# EAGLE design IOIO-OTG (EAGLE 7.2.0)
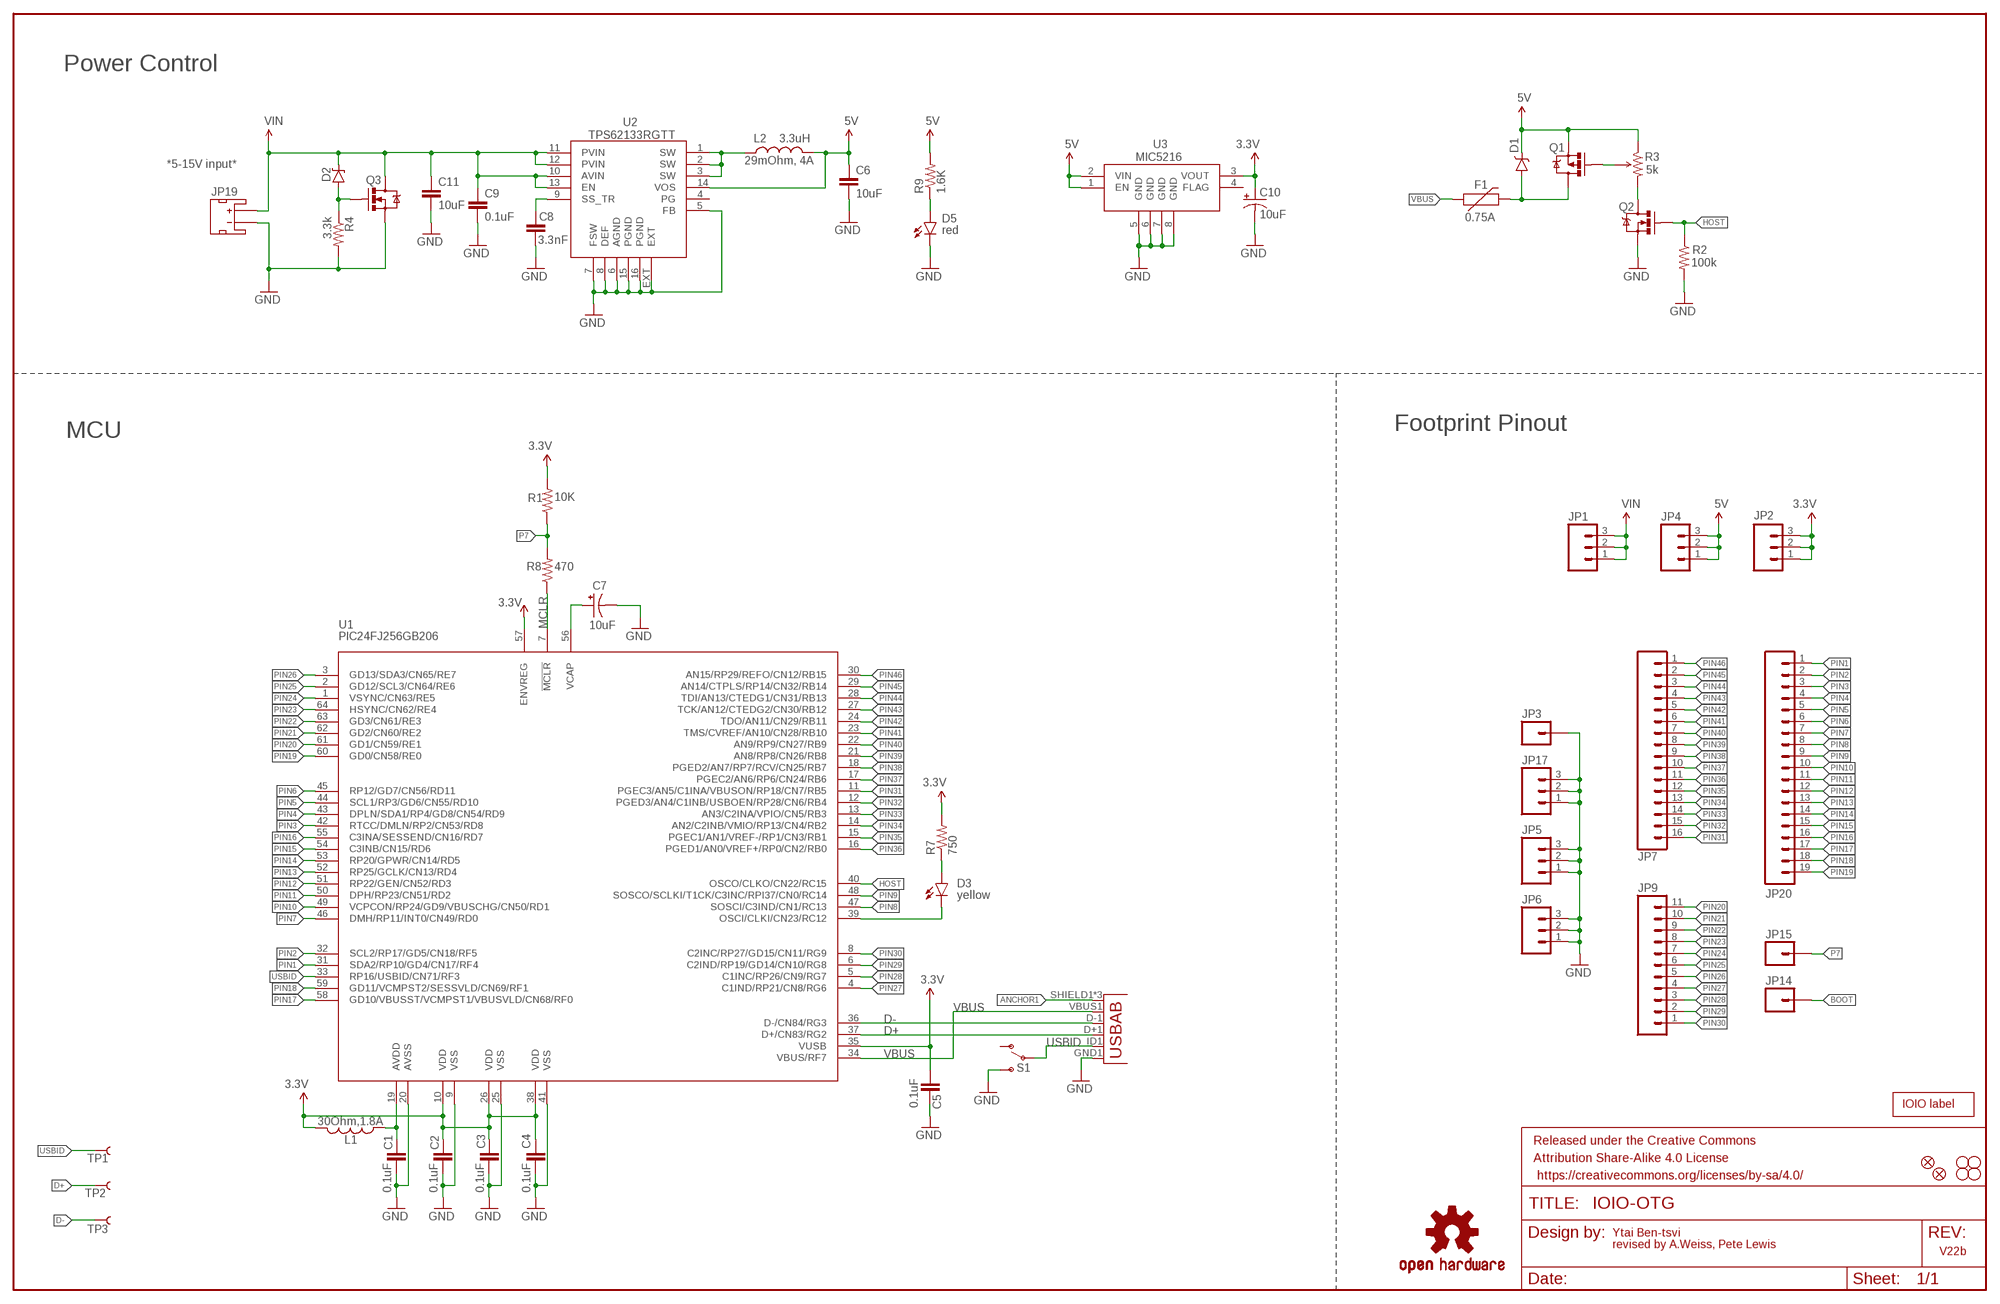
[diagram p0: schematic, sheet 1]

## Parts
C1  0.1uF  0.1UF-25V(+80/-20%)(0603)  [0603-CAP]
C2  0.1uF  0.1UF-25V(+80/-20%)(0603)  [0603-CAP]
C3  0.1uF  0.1UF-25V(+80/-20%)(0603)  [0603-CAP]
C4  0.1uF  0.1UF-25V(+80/-20%)(0603)  [0603-CAP]
C5  0.1uF  0.1UF-25V(+80/-20%)(0603)  [0603-CAP]
C6  10uF  10UF10V10%(0805)  [0805-CAP]
C7  10uF  10UF-16V-10%(TANT)  [EIA3216]
C8  3.3nF  3.3NF-100V-10%(0603)  [0603-CAP]
C9  0.1uF  0.1UF-25V(+80/-20%)(0603)  [0603-CAP]
C10  10uF  10UF-16V-10%(TANT)  [EIA3216]
C11  10uF  10UF50V20%(1210)  [1210]
D1  B340A  DIODE-SCHOTTKY-B340A  [SMA-DIODE]
D2  DZ2J160M0L  DIODE-ZENERDZ2J150M0L  [PANASONIC_SMINI2-F5-B]
D3  Yellow  LED-YELLOW0603-SMART  [LED-0603]
D5  Red  LED-RED0603-SMART  [LED-0603]
F1  0.75A  PTCSMD  [PTC-1206]
FRAME2  FRAME-LEDGER  [CREATIVE_COMMONS]
JP1  M03PTH  [1X03]
JP2  M03PTH  [1X03]
JP3  M01PTH  [1X01]
JP4  M03PTH  [1X03]
JP5  M03PTH  [1X03]
JP6  M03PTH  [1X03]
JP7  M161X16_NO_SILK  [1X16_NO_SILK]
JP8  FIDUCIALUFIDUCIAL  [MICRO-FIDUCIAL]
JP9  M111X11_NO_SILK  [1X11_NO_SILK]
JP10  STAND-OFF  [STAND-OFF]
JP11  STAND-OFF  [STAND-OFF]
JP12  STAND-OFF  [STAND-OFF]
JP13  STAND-OFF  [STAND-OFF]
JP14  M01PTH  [1X01]
JP15  M01PTH  [1X01]
JP16  FIDUCIALUFIDUCIAL  [MICRO-FIDUCIAL]
JP17  M03PTH  [1X03]
JP19  JST  JST_2MM_MALE  [JST-2-SMD]
JP20  M191X19_NO_SILK  [1X19_NO_SILK]
JP21  AB MICRO USB  USB-ABCONN-11794  [USB-AB-MICRO-SMD_V03]
L1  30Ohm,1.8A  INDUCTOR30OHM,1.8A  [0603]
L2  VLC5045T-3R3N  INDUCTORCR54-3.3UH  [CR54]
LOGO1  OSHW-LOGOS  [OSHW-LOGO-S]
Q1  IRLML2244  MOSFET-PCHANNELIRLML2244  [SOT23-3]
Q2  2N7002PW  MOSFET-NCHANNEL2N7002PW  [SOT323]
Q3  MOSFET-NCHANNELAO3404A  [SOT23-3]
R1  10K  10KOHM-1/10W-1%(0603)0603  [0603-RES]
R2  100k  100KOHM-1/10W-1%(0603)  [0603-RES]
R3  TS53YL502MR10  TRIMPOTRES-11156  [TRIMPOT_5MM]
R4  3.3k  3.3KOHM1/10W1%(0603)  [0603-RES]
R7  750  750OHM1/10W1%(0603)0603  [0603-RES]
R8  470  470OHM1/10W1%(0603)  [0603-RES]
R9  1.6K  1.6KOHM-1/10W-1%(0603)0603  [0603-RES]
S1  SWITCH_SPDT  [KPS-1290]
TP1  TEST-POINT3  [PAD.03X.03]
TP2  TEST-POINT3  [PAD.03X.03]
TP3  TEST-POINT3  [PAD.03X.03]
U1  PIC24FJ256GB206  PIC24FXXXGPX06  [PIC24FXXX_TQFP64]
U2  TPS62133RGTT  TPS62133RGTT""  [QFN16-3X3MM_1:1_V03]
U3  MIC5216  V_REG_MIC5216  [MSOP8]
U$6  IOIO-OTG  [IOIO-OTG-COPPER-EXPOSED]

## Nets
3.3V: C2.1 C3.1 C4.1 C5.1 C10.A(+) JP2.1 JP2.2 JP2.3 L1.2 R1.2 R7.2 U1.10(VDD) U1.26(VDD) U1.35(VUSB) U1.38(VDD) U1.57(ENVREG) U3.3(VOUT)
5V: C6.1 D1.C JP4.1 JP4.2 JP4.3 L2.P$2 Q1.2(S) R3.A(CCW) R9.2 U2.14(VOS) U3.1(EN) U3.2(VIN)
ANCHOR1: JP21.SHIELD1(SHIELD) JP21.SHIELD2(SHIELD) JP21.SHIELD3(SHIELD)
BOOT: D3.C JP14.1 U1.39(OSCI/CLKI/CN23/RC12)
D+: JP21.D+1(D+) TP2.P$1 U1.37(D+/CN83/RG2)
D-: JP21.D-1(D-) TP3.P$1 U1.36(D-/CN84/RG3)
GND: C1.2 C2.2 C3.2 C4.2 C5.2 C6.2 C7.C(-) C8.2 C9.2 C10.C(-) C11.2 D5.C JP3.1 JP5.1 JP5.2 JP5.3 JP6.1 JP6.2 JP6.3 JP17.1 JP17.2 JP17.3 JP19.1(-) JP21.GND1(GND) Q2.2(S) Q3.2(S) R2.2 R4.2 S1.S U1.9(VSS) U1.20(AVSS) U1.25(VSS) U1.41(VSS) U2.5(FB) U2.6(AGND) U2.7(FSW) U2.8(DEF) U2.15(PGND) U2.16(PGND) U2.EXT U3.5(GND) U3.6(GND) U3.7(GND) U3.8(GND)
HOST: Q2.1(G) R2.1 U1.40(OSCO/CLKO/CN22/RC15)
MCLR: R8.1 U1.7(!MCLR)
N$1: Q1.1(G) R3.B(WIPER)
N$2: D3.A R7.1
N$3: D5.A R9.1
N$4: D1.A F1.2 Q1.3(D)
N$5: C7.A(+) U1.56(VCAP)
N$6: L2.P$1 U2.1(SW) U2.2(SW) U2.3(SW)
N$7: C8.1 U2.9(SS_TR)
N$8: Q2.3(D) R3.C(CW)
N$9: C1.1 L1.1 U1.19(AVDD)
N$12: D2.A Q3.1(G) R4.1
P7: JP15.1 R1.1 R8.2
PIN1: JP20.1 U1.31(SDA2/RP10/GD4/CN17/RF4)
PIN2: JP20.2 U1.32(SCL2/RP17/GD5/CN18/RF5)
PIN3: JP20.3 U1.42(RTCC/DMLN/RP2/CN53/RD8)
PIN4: JP20.4 U1.43(DPLN/SDA1/RP4/GD8/CN54/RD9)
PIN5: JP20.5 U1.44(SCL1/RP3/GD6/CN55/RD10)
PIN6: JP20.6 U1.45(RP12/GD7/CN56/RD11)
PIN7: JP20.7 U1.46(DMH/RP11/INT0/CN49/RD0)
PIN8: JP20.8 U1.47(SOSCI/C3IND/CN1/RC13)
PIN9: JP20.9 U1.48(SOSCO/SCLKI/T1CK/C3INC/RPI37/CN0/RC14)
PIN10: JP20.10 U1.49(VCPCON/RP24/GD9/VBUSCHG/CN50/RD1)
PIN11: JP20.11 U1.50(DPH/RP23/CN51/RD2)
PIN12: JP20.12 U1.51(RP22/GEN/CN52/RD3)
PIN13: JP20.13 U1.52(RP25/GCLK/CN13/RD4)
PIN14: JP20.14 U1.53(RP20/GPWR/CN14/RD5)
PIN15: JP20.15 U1.54(C3INB/CN15/RD6)
PIN16: JP20.16 U1.55(C3INA/SESSEND/CN16/RD7)
PIN17: JP20.17 U1.58(GD10/VBUSST/VCMPST1/VBUSVLD/CN68/RF0)
PIN18: JP20.18 U1.59(GD11/VCMPST2/SESSVLD/CN69/RF1)
PIN19: JP20.19 U1.60(GD0/CN58/RE0)
PIN20: JP9.11 U1.61(GD1/CN59/RE1)
PIN21: JP9.10 U1.62(GD2/CN60/RE2)
PIN22: JP9.9 U1.63(GD3/CN61/RE3)
PIN23: JP9.8 U1.64(HSYNC/CN62/RE4)
PIN24: JP9.7 U1.1(VSYNC/CN63/RE5)
PIN25: JP9.6 U1.2(GD12/SCL3/CN64/RE6)
PIN26: JP9.5 U1.3(GD13/SDA3/CN65/RE7)
PIN27: JP9.4 U1.4(C1IND/RP21/CN8/RG6)
PIN28: JP9.3 U1.5(C1INC/RP26/CN9/RG7)
PIN29: JP9.2 U1.6(C2IND/RP19/GD14/CN10/RG8)
PIN30: JP9.1 U1.8(C2INC/RP27/GD15/CN11/RG9)
PIN31: JP7.16 U1.11(PGEC3/AN5/C1INA/VBUSON/RP18/CN7/RB5)
PIN32: JP7.15 U1.12(PGED3/AN4/C1INB/USBOEN/RP28/CN6/RB4)
PIN33: JP7.14 U1.13(AN3/C2INA/VPIO/CN5/RB3)
PIN34: JP7.13 U1.14(AN2/C2INB/VMIO/RP13/CN4/RB2)
PIN35: JP7.12 U1.15(PGEC1/AN1/VREF-/RP1/CN3/RB1)
PIN36: JP7.11 U1.16(PGED1/AN0/VREF+/RP0/CN2/RB0)
PIN37: JP7.10 U1.17(PGEC2/AN6/RP6/CN24/RB6)
PIN38: JP7.9 U1.18(PGED2/AN7/RP7/RCV/CN25/RB7)
PIN39: JP7.8 U1.21(AN8/RP8/CN26/RB8)
PIN40: JP7.7 U1.22(AN9/RP9/CN27/RB9)
PIN41: JP7.6 U1.23(TMS/CVREF/AN10/CN28/RB10)
PIN42: JP7.5 U1.24(TDO/AN11/CN29/RB11)
PIN43: JP7.4 U1.27(TCK/AN12/CTEDG2/CN30/RB12)
PIN44: JP7.3 U1.28(TDI/AN13/CTEDG1/CN31/RB13)
PIN45: JP7.2 U1.29(AN14/CTPLS/RP14/CN32/RB14)
PIN46: JP7.1 U1.30(AN15/RP29/REFO/CN12/RB15)
USBID: JP21.ID1(USBID) S1.P TP1.P$1 U1.33(RP16/USBID/CN71/RF3)
VBUS: F1.1 JP21.VBUS1(VBUS) U1.34(VBUS/RF7)
VIN: C9.1 C11.1 D2.C JP1.1 JP1.2 JP1.3 JP19.2(+) Q3.3(D) U2.10(AVIN) U2.11(PVIN) U2.12(PVIN) U2.13(EN)
Unconnected: JP19.NC1(PAD1) JP19.NC2(PAD2) S1.O U2.4(PG) U3.4(FLAG)

## Notes on the sheet
- Power Control
- 29mOhm, 4A
- *5-15V input*
- 5k
- 0.75A
- red
- Footprint Pinout
- MCU
- yellow
- Ytai Ben-tsvi
- revised by A.Weiss, Pete Lewis
- V22b

## Library data of the parts
C1-C5 C9 = SparkFun-Capacitors:0.1UF-25V(+80/-20%)(0603): CAP-00810 Ceramic Standard decoupling cap; PROD_ID: CAP-00810
C6 = SparkFun-Capacitors:10UF10V10%(0805): CAP-11330; PART#: LMK212BJ106KG-T; PROD_ID: CAP-11330
C7 = SparkFun-Capacitors:10UF-16V-10%(TANT): CAP-00811 1206/EIA-3216 Tantalum capacitor; PROD_ID: CAP-00811
C8 = SparkFun-Capacitors:3.3NF-100V-10%(0603): CAP-09633; PROD_ID: CAP-09633
C10 = SparkFun-Capacitors:10UF-16V-10%(TANT): CAP-00811 1206/EIA-3216 Tantalum capacitor; PART#: TAJA106K016RNJ; PROD_ID: CAP-00811
C11 = SparkFun-Capacitors:10UF50V20%(1210): CAP-09824; PART#: UMK325C7106MM-T; PROD_ID: CAP-09824
D1 = SparkFun-DiscreteSemi:DIODE-SCHOTTKY: Schottky diodes in SFE's production catalog BAT20J 1A 23V 0.62Vf RB751 120mA 40V 0.37Vf PMEG4005EJ 0.5A 40V 0.42Vf MBRA140 1A 40V 0.5Vf B340A 3A 40V SMA; PART#: B340A; PROD_ID: DIO-09886
D2 = SparkFun-DiscreteSemi:DIODE-ZENER: Zener Diode Production Part - 8199 3.4V Zener Voltage; PART#: DZ2J150M0L; PROD_ID: DIO-12989
D3 = SparkFun-LED:LED-YELLOW: Yellow SMD LEDs LilyPad 1206- DIO-09909 0603- DIO-09003 "SMART" means more efficient and expensive; PROD_ID: DIO-11230
D5 = SparkFun-LED:LED-RED: Assorted Red LEDs LilyPad 1206- DIO-09912 1206- DIO-00809 0603- DIO-00819 "SMART" means more efficient and expensive; PROD_ID: DIO-11154
F1 = SparkFun-PowerIC:PTC: Resettable Fuse PTC Resettable Fuse. Spark Fun Electronics SKU : COM-08357; PART#: 0ZCA0075FF2G; PROD_ID: RES-11150
FRAME2 = SparkFun-Aesthetics:FRAME-LEDGER: Schematic Frame Standard 11x14 US Ledger frame
JP1 JP2 JP4-JP6 JP17 = SparkFun:M03: Header 3 Standard 3-pin 0.1" header. Use with straight break away headers (SKU : PRT-00116), right angle break away headers (PRT-00553), swiss pins (PRT-00743), machine pins (PRT-00117), and female headers (PRT-00115). Molex polarized connector foot print use with SKU : PRT-08232 with associated crimp pins and housings.
JP3 JP14 JP15 = SparkFun:M01: Header 1 Standard 1-pin 0.1" header. Use with straight break away headers (SKU : PRT-00116), right angle break away headers (PRT-00553), swiss pins (PRT-00743), machine pins (PRT-00117), and female headers (PRT-00115).
JP7 = SparkFun-Connectors:M16: 1x16 .1" header
JP8 JP16 = SparkFun:FIDUCIAL: Fiducial Alignment Points Various fiducial points for machine vision alignment.
JP9 = SparkFun-Connectors:M11: Header 11 Standard 11-pin 0.1" header. Use with straight break away headers (SKU : PRT-00116), right angle break away headers (PRT-00553), swiss pins (PRT-00743), machine pins (PRT-00117), and female headers (PRT-00115).
JP10-JP13 = SparkFun:STAND-OFF: Stand Off This is the mechanical footprint for a #4 phillips button head screw. Use the keepout ring to avoid running the screw head into surrounding components. SKU : PRT-00447
JP19 = SparkFun-Connectors:JST_2MM_MALE: Mates to single-cell LiPo batteries. CONN-11443 Now with smashable polarity marks!; BTM_NEG: -; BTM_POS: +; PROD_ID: CONN-11443; TOP_NEG: -; TOP_POS: +
JP20 = SparkFun-Connectors:M19: 1x19 .1" header
JP21 = SparkFun-Connectors:USB-AB: This is a USB AB connector that is compatible with USB OTG. i.e. this connector can serve as a host or device; PROD_ID: CONN-11794
L1 = SparkFun-Passives:INDUCTOR: Inductors Basic Inductor/Choke - 0603 and 1206. Footprints are not proven and vary greatly between part numbers. INDUCTOR POWER 3.3UH 4.0A SMD 0.197" L x 0.197" W x 0.177" H (5.00mm x 5.00mm x 4.50mm); PROD_ID: RES-07859
L2 = SparkFun-Passives:INDUCTOR: Inductors Basic Inductor/Choke - 0603 and 1206. Footprints are not proven and vary greatly between part numbers. INDUCTOR POWER 3.3UH 4.0A SMD 0.197" L x 0.197" W x 0.177" H (5.00mm x 5.00mm x 4.50mm); AM: 3.3uH; PROD_ID: NDUC-11157
LOGO1 = SparkFun-Aesthetics:OSHW-LOGO: Open Source Hardware Logo This logo indicates the piece of hardware it is found on incorporates a OSHW license and/or adheres to the definition of open source hardware found here: http://freedomdefined.org/OSHW
Q1 = SparkFun-DiscreteSemi:MOSFET-PCHANNEL: Generic PMOSFET IRLML2244 - TRANS-11153 (SOT-23 -20V -4.3A) (1.Gate 2.Source 3.Drain) FQP27P06 - COM-10349 <http://www.sparkfun.com/products/10349> (TO-220 -60V -27A) (1.Gate 2.Source 3.Drain); PROD_ID: TRANS-11153
Q2 = SparkFun-DiscreteSemi:MOSFET-NCHANNEL: Common NMOSFET Parts MFG P/N Store ID Prod ID FDD8780 TRANS-09984 SI7820DN TRANS-11055 FDS6630A IC-08089 2N7002PW TRANS-11151 FQP30N06L COM-10213 TRANS-10060 BSS123LT1G TRANS-08345 BSS138 TRANS-00830 BS170 2N7000; PART#: 2N7002PW; PROD_ID: TRANS-11151
Q3 = SparkFun-DiscreteSemi:MOSFET-NCHANNEL: Common NMOSFET Parts MFG P/N Store ID Prod ID FDD8780 TRANS-09984 SI7820DN TRANS-11055 FDS6630A IC-08089 2N7002PW TRANS-11151 FQP30N06L COM-10213 TRANS-10060 BSS123LT1G TRANS-08345 BSS138 TRANS-00830 BS170 2N7000; PART#: AO3404A; PROD_ID: TRAN-12988
R1 = SparkFun-Resistors:10KOHM-1/10W-1%(0603): RES-00824; PROD_ID: RES-00824
R2 = SparkFun-Resistors:100KOHM-1/10W-1%(0603): RES-07828; PROD_ID: RES-07828
R3 = SparkFun-Electromechanical:TRIMPOT: Various small potentiometers for "set-and-forget" applications; PART#: TS53YL502MR10; PROD_ID: RES-11156
R4 = SparkFun-Resistors:3.3KOHM1/10W1%(0603): RES-07851; PROD_ID: RES-07851
R7 = SparkFun-Resistors:750OHM1/10W1%(0603): RES-07824; PROD_ID: RES-07824
R8 = SparkFun-Resistors:470OHM1/10W1%(0603): RES-07869; PROD_ID: RES-07869
R9 = SparkFun-Resistors:1.6KOHM-1/10W-1%(0603): RES-08361; PROD_ID: RES-08361
S1 = SparkFun-Electromechanical:SWITCH_SPDT: SWCH-10651 Side-actuated SPDT slide switch, as used on the Arduino Pro; PROD_ID: SWCH-10651
TP1-TP3 = SparkFun-Passives:TEST-POINT: Bare copper test points for troubleshooting or ICT
U1 = SparkFun-DigitalIC:PIC24FXXXGPX06: PIC24FXXXGPX06 PIC24FXXXGP106 / PIC24FXXXDA206 PIC24FJ256GP206-I/PT for IOIO IC-11312; PROD_ID: IC-11312
U2 = SparkFun-PowerIC:TPS62133RGTT: 3-17V, 2A Step Down Converter; PROD_ID: IC-11155
U3 = SparkFun-PowerIC:V_REG_MIC5216: 500mA LDO, MSOP8 for better dissipation; PROD_ID: IC-09527
U$6 = SparkFun-Aesthetics:IOIO-OTG: Labels for the IOIO-OTG

## Board
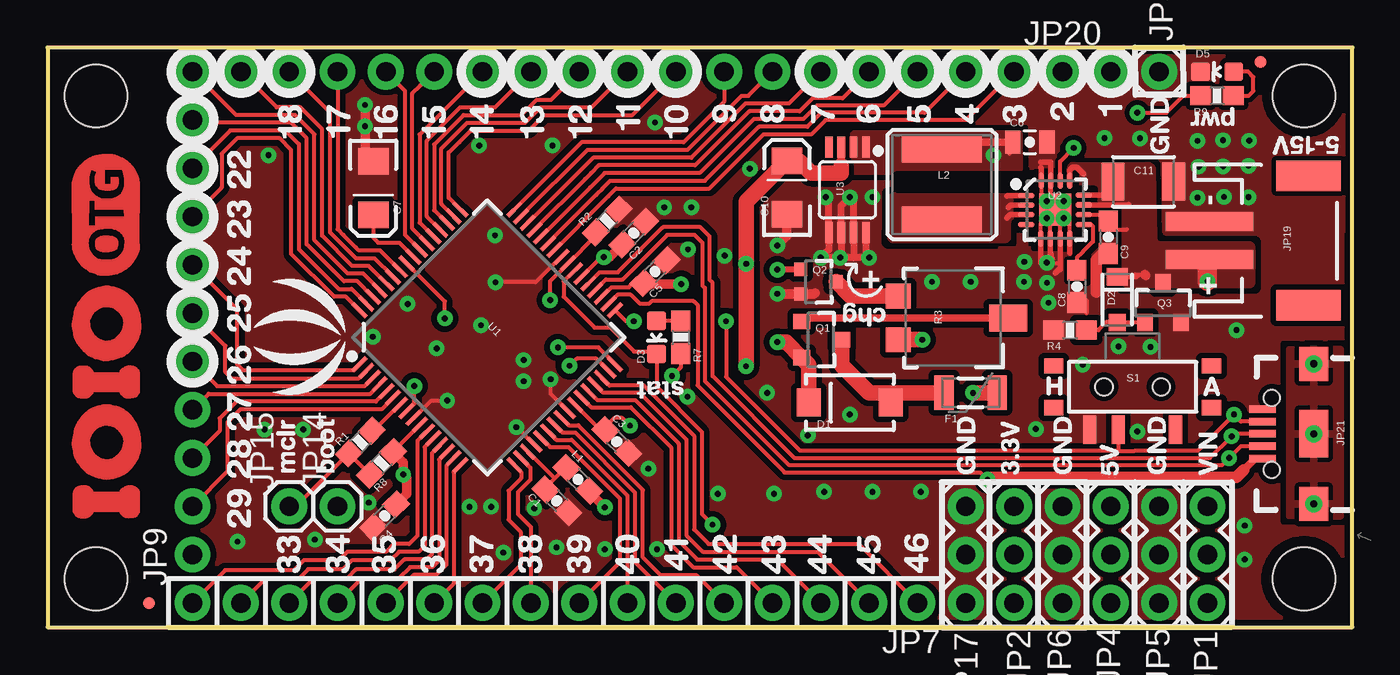
[diagram p1: board, top side]
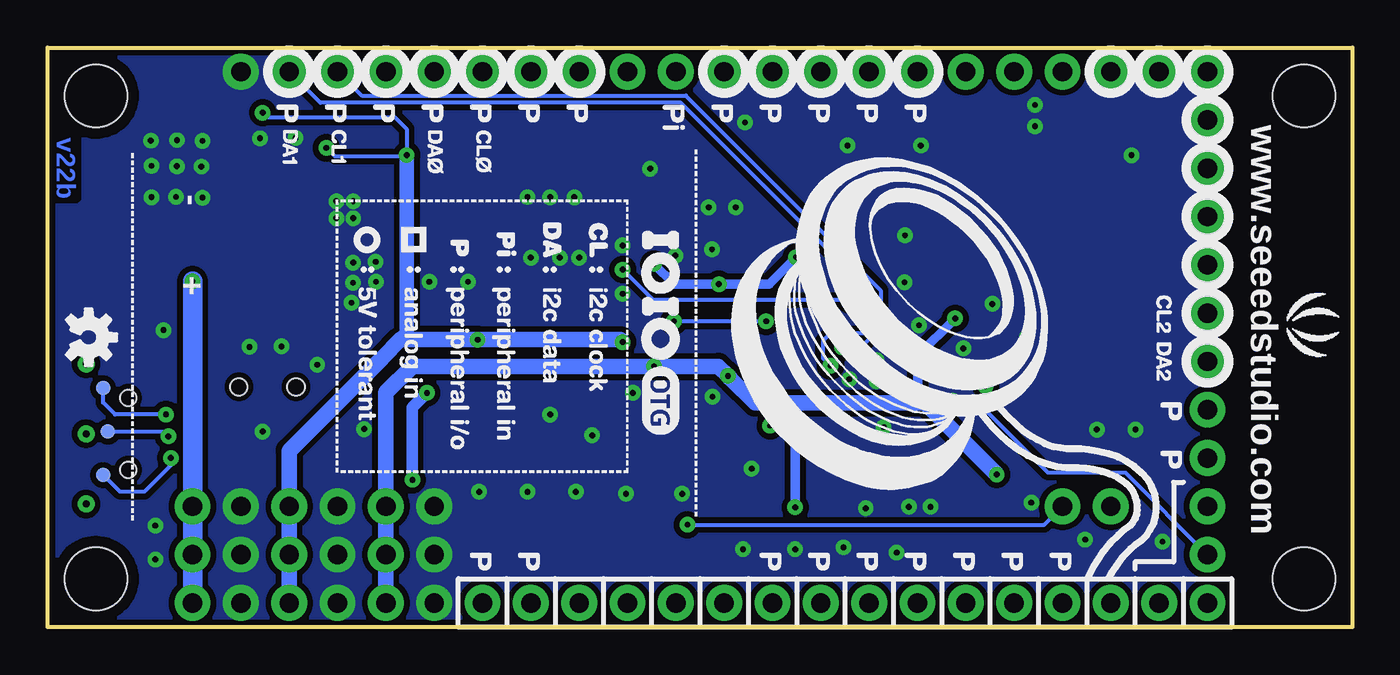
[diagram p2: board, bottom side, seen from below]

Size 68.58 x 30.48 mm. Coordinates in mm from the lower left corner, seen from the top.
Outline: 0,0 68.58,0 68.58,30.48 0,30.48 0,0
Copper layers (1*16): Top 0.035mm / dielectric 1.5mm / Bottom 0.035mm
Design rules "SparkFun-2-layer *": minimum track width 8mil, minimum drill 12mil, track to track 7mil, track to pad 8mil, pad to pad 8mil, via to via 8mil, smd to smd 8mil, copper to edge 8mil, drill to drill 8mil, minimum pad ring 12mil, minimum via ring 10mil, stop-mask expansion 4mil, vias tented up to drill 20mil, thermal gap 10mil
tRestrict: area 44.6,23 to 51.6,23.7; area 54.1,22.4 to 55,22.6; area 54.1,21.9 to 55,22.1; area 54.2,22.9 to 55,23.1; area 53.9,23 to 54.1,23.9; area 52.9,23.1 to 53.1,24; area 52.4,23.1 to 52.6,23.9; area 51.9,23 to 52.1,23.9; area 50.9,22.8 to 51.8,23; area 50.9,22.3 to 51.8,22.5; area 50.9,21.8 to 51.8,22; area 50.9,21.3 to 51.8,21.5; area 52.4,19.9 to 52.6,20.8; area 52.9,19.9 to 53.1,20.8; area 53.4,19.9 to 53.6,20.8; area 53.9,19.9 to 54.1,20.8; area 51.8,19.9 to 52,20.8; area 52,21 to 52.1,22.8; area 53.8,21 to 54,22.8; area 52.3,20.9 to 52.6,21.1; area 52.8,20.9 to 53.1,21.1; area 53.3,20.9 to 53.6,21.1; area 52.3,22.8 to 52.6,23; area 52.8,22.8 to 53.1,23; area 53.3,22.8 to 53.6,23

### Footprints (pad centres in the part's own frame; a part is rotated, then mirrored left to right if it is on the bottom)
0603-CAP = smd 1.1 x 1: 1 -0.85,0; 2 0.85,0
0805-CAP = smd 0.8 x 1.2: 1 -0.9,0; 2 0.9,0
EIA3216 = smd 1.4 x 1.6: A 1.4,0; C -1.4,0
1210 = smd 1.2 x 2: 1 -1.6,0; 2 1.6,0
SMA-DIODE = smd 1.27 x 1.47: A -2.15,0; C 2.15,0
PANASONIC_SMINI2-F5-B = smd 0.9 x 0.9: A 1.2,0 | smd 0.9 x 1.1: C -1.2,0
LED-0603 = smd 1 x 1: A 0,-0.877; C 0,0.877
PTC-1206 = smd 1 x 1.8: 1 -1.4,0; 2 1.4,0
1X03 = drill 1.016 pad 1.88: 1 0,0; 2 2.54,0; 3 5.08,0
1X01 = drill 1.016 pad 1.88: 1 0,0
1X16_NO_SILK = drill 1.016 pad 1.88: 1 0,0; 2 2.54,0; 3 5.08,0; 4 7.62,0; 5 10.16,0; 6 12.7,0; 7 15.24,0; 8 17.78,0; 9 20.32,0; 10 22.86,0; 11 25.4,0; 12 27.94,0; 13 30.48,0; 14 33.02,0; 15 35.56,0; 16 38.1,0
MICRO-FIDUCIAL = smd 0.635 x 0.635: 1 0,0
1X11_NO_SILK = drill 1.016 pad 1.88: 1 0,0; 2 2.54,0; 3 5.08,0; 4 7.62,0; 5 10.16,0; 6 12.7,0; 7 15.24,0; 8 17.78,0; 9 20.32,0; 10 22.86,0; 11 25.4,0
STAND-OFF = hole 3.302: 0,0
JST-2-SMD = smd 1 x 4.6: 1 -1,-3.7; 2 1,-3.7 | smd 1.6 x 3.4: NC1 -3.4,1.5; NC2 3.4,1.5
1X19_NO_SILK = drill 1.016 pad 1.88: 1 0,0; 2 2.54,0; 3 5.08,0; 4 7.62,0; 5 10.16,0; 6 12.7,0; 7 15.24,0; 8 17.78,0; 9 20.32,0; 10 22.86,0; 11 25.4,0; 12 27.94,0; 13 30.48,0; 14 33.02,0; 15 35.56,0; 16 38.1,0; 17 40.64,0; 18 43.18,0; 19 45.72,0
USB-AB-MICRO-SMD_V03 = smd 1.4 x 0.4: D+1 2.7,0; D-1 2.7,0.65; GND1 2.7,-1.3; ID1 2.7,-0.65; VBUS1 2.7,1.3 | smd 1.5 x 1.8: SHIELD1 0,3.68; SHIELD3 0,-3.68 | smd 1.5 x 2.5: SHIELD2 0,0 | hole 0.85: 2.2,1.9; 2.2,-1.9
0603 = smd 1.1 x 1: 1 -0.85,0; 2 0.85,0
CR54 = smd 4.2 x 1.4: P$1 0,1.85; P$2 0,-1.85
SOT23-3 = smd 0.8 x 0.9: 1 -0.95,-1; 2 0.95,-1; 3 0,1.1
SOT323 = smd 0.7 x 0.7: 1 -0.65,-0.925; 2 0.65,-0.925; 3 0,0.925
0603-RES = smd 1.1 x 1: 1 -0.85,0; 2 0.85,0
TRIMPOT_5MM = smd 1.3 x 1.3: A 1.15,-2.54; C -1.15,-2.54 | smd 1.402 x 2: B 0,3.239
KPS-1290 = smd 0.7 x 1.5: O -2.25,2.25; P 0.75,2.25; S 2.25,2.25 | smd 1 x 0.8: P$1 -4.15,1.1; P$2 -4.15,-1.1; P$3 4.15,-1.1; P$4 4.15,1.1 | hole 0.9: -1.5,0; 1.5,0
PAD.03X.03 = smd 0.762 x 0.762: P$1 0,0
PIC24FXXX_TQFP64 = smd 0.22 x 1: 1 -3.75,-5.75; 2 -3.25,-5.75; 3 -2.75,-5.75; 4 -2.25,-5.75; 5 -1.75,-5.75; 6 -1.25,-5.75; 7 -0.75,-5.75; 8 -0.25,-5.75; 9 0.25,-5.75; 10 0.75,-5.75; 11 1.25,-5.75; 12 1.75,-5.75; 13 2.25,-5.75; 14 2.75,-5.75; 15 3.25,-5.75; 16 3.75,-5.75; 33 3.75,5.75; 34 3.25,5.75; 35 2.75,5.75; 36 2.25,5.75; 37 1.75,5.75; 38 1.25,5.75; 39 0.75,5.75; 40 0.25,5.75; 41 -0.25,5.75; 42 -0.75,5.75; 43 -1.25,5.75; 44 -1.75,5.75; 45 -2.25,5.75; 46 -2.75,5.75; 47 -3.25,5.75; 48 -3.75,5.75 | smd 1 x 0.22: 17 5.75,-3.75; 18 5.75,-3.25; 19 5.75,-2.75; 20 5.75,-2.25; 21 5.75,-1.75; 22 5.75,-1.25; 23 5.75,-0.75; 24 5.75,-0.25; 25 5.75,0.25; 26 5.75,0.75; 27 5.75,1.25; 28 5.75,1.75; 29 5.75,2.25; 30 5.75,2.75; 31 5.75,3.25; 32 5.75,3.75; 49 -5.75,3.75; 50 -5.75,3.25; 51 -5.75,2.75; 52 -5.75,2.25; 53 -5.75,1.75; 54 -5.75,1.25; 55 -5.75,0.75; 56 -5.75,0.25; 57 -5.75,-0.25; 58 -5.75,-0.75; 59 -5.75,-1.25; 60 -5.75,-1.75; 61 -5.75,-2.25; 62 -5.75,-2.75; 63 -5.75,-3.25; 64 -5.75,-3.75
QFN16-3X3MM_1:1_V03 = smd 0.85 x 0.28: 1 -1.524,0.75; 2 -1.524,0.253; 3 -1.529,-0.25; 4 -1.527,-0.774; 9 1.503,-0.77; 10 1.498,-0.245; 11 1.498,0.255; 12 1.495,0.755 | smd 0.28 x 0.85: 5 -0.765,-1.513; 6 -0.265,-1.513; 7 0.263,-1.513; 8 0.763,-1.513; 13 0.758,1.518; 14 0.258,1.518; 15 -0.247,1.518; 16 -0.742,1.518 | smd 1.68 x 1.68: EXT -0.009,0.008
MSOP8 = smd 0.4 x 1.1: 1 -0.975,-2.25; 2 -0.325,-2.25; 3 0.325,-2.25; 4 0.975,-2.25; 5 0.975,2.25; 6 0.325,2.25; 7 -0.325,2.25; 8 -0.975,2.25

### Placement (x,y rotation side)
C1  26.77,6.63 315 top
C2  30.81,20.73 45 top
C3  29.92,9.75 315 top
C4  17.71,5.85 225 top
C5  31.93,18.69 45 top
C6  51.63,25.51 0 top
C7  17.12,23.09 270 top
C8  54.1,17.91 270 top
C9  55.75,20.5 270 top
C10  38.86,23.11 90 top
C11  57.6,23.43 0 top
D1  42.16,11.81 180 top
D2  56.21,17.22 270 top
D3  32,15.24 180 top
D5  61.47,29.21 90 top
F1  48.51,12.32 180 top
FRAME2  5.08,-11.43 0 top  (outside the outline)
JP1  60.96,1.27 90 top
JP2  50.8,6.35 270 top
JP3  58.42,29.21 0 top
JP4  55.88,6.35 270 top
JP5  58.42,6.35 270 top
JP6  53.34,6.35 270 top
JP7  45.72,1.27 180 top
JP8  5.33,1.27 0 top
JP9  7.62,3.81 90 top
JP10  66.04,27.94 0 top
JP11  66.04,2.54 0 top
JP12  2.54,27.94 0 top
JP13  2.54,2.54 0 top
JP14  15.24,6.35 0 top
JP15  12.7,6.35 0 top
JP16  63.75,29.72 0 top
JP17  48.26,1.27 90 top
JP19  64.77,20.32 270 top
JP20  55.88,29.21 180 top
JP21  66.55,10.16 180 top
L1  27.87,7.77 315 top
L2  47.01,23.28 180 top
LOGO1  66.42,15.24 270 bottom
Q1  40.64,15.11 270 top
Q2  40.51,18.16 270 top
Q3  58.63,17.02 0 top
R1  17.55,8.61 45 top
R2  29.41,21.36 45 top
R3  47.24,16.26 270 top
R4  53.74,15.61 180 top
R7  33.27,15.24 270 top
R8  16.43,9.73 225 top
R9  61.47,27.94 180 top
S1  57.02,12.64 180 top
TP1  65.66,12.57 0 bottom
TP2  65.41,10.29 0 bottom
TP3  65.66,8 0 bottom
U1  23.11,15.24 315 top
U2  52.96,21.95 0 top
U3  42.04,22.99 180 top
U$6  4.83,5.71 90 top
U$13  [LOGO_SILK]  13.97,15.24 90 top
U$15  [SMALL_SEEED_LOGO]  1.91,15.88 270 bottom

### Tracks (layer width: path | path; a pad name or v marks a point on that pad's centre or on a via)
3.3V  (via drill 0.3 pad 0.64)
  Top 0.203: U1.38 29.1,19.46 v29.23,19.46 | 31.14,17.91 C5.1 | U1.57 20.88,17.12 v20.88,16.23 | U1.10 R1.2 | v30.61,10.59 30.18,11.02 29.82,11.02 29.32,10.52 C3.1 29.06,10.36 U1.26 | R7.2 33.27,13.66 v32.82,13.21 | 31.67,18.03 31.61,18.09 C5.1 | U1.35 29.64,17.88 30.56,17.88 | 30.56,17.88 30.58,17.91 | 30.71,18.03 30.56,17.88 | 30.76,18.08 30.71,18.03 | 30.71,18.03 | 30.71,18.03 30.77,18.09 C5.1 | 41.71,24.57 41.71,24.56 41.71,24.13
  Top 0.406: U3.3 41.71,24.57
  Top 0.508: 33.33,14.54 arc90 R7.2 | v33.3,18.03 31.67,18.03 | v29.23,19.46 29.54,19.46 C2.1 | R1.2 18.69,8.67 v18.69,8.03 18.87,7.85 18.87,7.01 C4.1 | L1.2 28.47,7.11 v29.29,6.3
  Top 0.813: 41.71,24.26 41.71,24.13 41.71,23.88 40.13,23.88 39.49,24.51 C10.A | C10.A 38.86,24.24 | C10.A 36.72,22.37 v36.72,19.1 36.72,13.73 v36.7,13.72
  Bottom 0.254: 30.99,11.68 30.89,11.68 30.79,11.79 30.5,11.79
  Bottom 0.508: v36.7,13.72 arc90 36.6,13.82 | 22.84,12.6 22.84,11.79 | 22.84,12.6 23.55,11.89 23.67,11.89 | v36.72,19.1 35.65,18.03 v33.3,18.03 30.66,18.03 v29.23,19.46 | 28.45,11.68 28.55,11.79 | 28.96,11.68 29.06,11.68 | 22.84,12.6 22.84,14.28 v20.88,16.23 | 29.23,11.79 30.5,11.79 30.61,11.68 v30.61,10.59 | 29.06,11.68 29.06,11.79 29.13,11.79 | 31.9,12.29 32.66,13.06 | v29.29,6.3 29.29,11.68 29.06,11.68
  Bottom 0.813: JP2.3 JP2.2 JP2.1 50.8,12.34 49.43,13.72 v36.7,13.72 33.33,13.72 v32.82,13.21 32.66,13.06 31.39,11.79 30.5,11.79 29.13,11.79 28.55,11.79 22.84,11.79 22.45,11.79 v18.69,8.03
5V  (via drill 0.3 pad 0.64)
  Top 0.203: v57.28,27.05 58.8,27.05 59.69,27.94 R9.2 | 50.56,24.89 50.82,25.15 | U2.14 53.22,24.49 v53.93,25.2
  Top 0.406: 47.26,25.51 C6.1
  Top 0.813: D1.C 40.01,13.79 Q1.2 38.82,14.99 v38.35,14.99 | v45.97,15.11 R3.A
  Bottom 0.203: v53.93,25.2 53.47,24.75 49.78,24.75 arc-90 v49.71,24.82 49.71,26.19 50.31,26.8 57.02,26.8 v57.28,27.05
  Bottom 0.762: v49.71,24.82 49.71,15.45 50.99,14.16
  Bottom 0.813: JP4.3 JP4.2 JP4.1 55.88,9.28 50.99,14.16 50.04,15.11 v45.97,15.11 38.48,15.11 v38.35,14.99
  pour Top (isolate 0.254, no thermals): 50.89,23.88 42.48,23.88 arc-90 42.23,24.13 42.23,25.78 arc-90 42.48,26.04 51.12,26.04 arc-90 51.12,26.03 51.15,24.13 arc-90
ANCHOR1  (via drill 0.38)
  other vias: 66.55,10.16 66.55,13.84 66.55,6.48
  pour Top: 65.28,14.61 67.94,14.61 67.94,5.84 65.28,5.84
BOOT  (via drill 0.3 pad 0.64)
  Top 0.203: U1.39 27.13,18.19 27.13,17.37 28.75,15.75 29.57,15.75 30.82,14.49 31.88,14.49 D3.C 32,12.65 34.39,10.26 34.39,5.94 v34.95,5.38
  Bottom 0.203: v34.95,5.38 16.2,5.38 JP14.1
D+  (via drill 0.3 pad 0.64)
  Top 0.203: U1.37 29.02,18.67 29.97,18.67 32.33,21.03 34.31,21.03 34.8,20.55 34.8,18.26 34.95,18.11 34.95,13.19 39.25,8.89 61.09,8.89 v62.23,10.03 62.36,10.16 JP21.D+1
  Bottom 0.203: TP2.P$1 62.48,10.29 v62.23,10.03
D-  (via drill 0.3 pad 0.64)
  Top 0.203: U1.36 29.34,18.29 30.23,18.29 32.56,20.62 34.01,20.62 34.42,20.22 34.42,17.96 34.54,17.83 34.54,12.95 38.98,8.51 61.72,8.51 v62.1,8.89 62.72,9.51 JP21.D-1
  Bottom 0.203: v62.1,8.89 62.1,8.51 63.5,7.11 64.77,7.11 TP3.P$1
GND  (via drill 0.3 pad 0.64)
  Top 0.203: U1.9 19.25,11 20.17,11.91 v21.01,11.91 | U1.20 | v24.64,10.52 24.66,10.52 U1.20 | U1.25 26.44,12.27 v26.44,13.03 | U1.41 25.66,18.14 v23.55,18.14 | U1.20 | 54.61,17.19 54.61,16.51 | 52.21,22.7 v52.51,22.39 52.22,22.69 U2.16 | 52.71,23.43 52.71,22.88 52.71,22.89 U2.15 | 52.71,22.88 52.71,22.42 | 53.71,21.2 v53.4,21.51 | 52.7,20.48 52.7,21.51 52.71,21.52 | 53.09,19.13 53.03,19.13 | U2.8 53.72,21.19 v53.4,21.51 | U2.7 53.22,21.32 v53.4,21.51 | U2.5 52.19,21.18 v52.51,21.51
  Top 0.279: 52.19,24.16 52.22,24.14 U2.16 | 52.19,24.46 52.21,24.45 52.71,24.45 U2.15 | 53.21,18.86 52.97,18.62 | 52.71,22.59 v52.51,22.39 | 52.71,22.39 v52.51,22.39 | 52.71,22.39 v52.51,22.39 | 52.71,22.42 52.52,22.42 | 52.7,21.51 v52.51,21.51 52.71,21.51 | v52.52,19.16 arc90 52.7,19.73 | 52.2,20.56 52.2,19.7 arc-90 52.21,19.69 52.21,19.14 52.22,19.13 | 53.21,21.31 v53.4,21.51 | 53.22,20.32 53.22,18.81 | 53.72,20.33 53.72,19.66 | U2.6 52.69,19.5 52.81,19.39
  Top 0.356: v41.66,19.43 41.71,19.49 U3.6 41.71,22.15 v42.16,22.61 42.36,22.41 U3.7 42.36,19.44 42.37,19.43 | U3.8 43.01,19.6 v43.18,19.43 42.37,19.43 | 42.37,19.43 v40.64,19.43 41.06,19.85 U3.5 41.06,22.44 v40.89,22.61
  Top 0.406: 55.65,19.55 C9.2 | 55.03,19.02 55.54,19.52
  Top 0.508: v38.35,17.53 38.37,17.51 Q2.2 40.27,17.51 40.34,17.58 | C10.C 38.86,20.57 v38.35,20.07 | v16.69,27.46 v16.69,26.34 16.69,24.92 C7.C
  Top 0.61: 55.12,17.63 55.12,19.29 55.57,19.74
  other vias: 53.4,22.4 40.82,7.11 43.36,7.11 45.9,7.11 42.16,11.18 46.48,18.16 48.51,18.16 60.5,24.22 61.79,24.24 63.12,24.26 51.34,19.21 43.36,22.61 32.41,22.07 61.78,25.61 63.15,25.58 55.55,25.72 57.41,25.71 51.32,18.16 60.43,22.58 63.12,22.61 57.96,14.73 51.94,10.41 33.66,19.86 62.48,15.62 61.83,22.63 54.41,13.79 52.53,18.11 56.29,14.76 57.28,10.29 22.17,6.32 14.05,4.6 17.09,15.27 22.78,15.88 18.92,16.99 20.45,14.66 23.52,20.6 31.93,26.54 22.68,25.32 26.54,25.32 11.61,24.82 9.98,4.5 23.95,3.91 26.75,4.19 29.29,4.09 25.58,6.25 31.57,8.33 38.18,7.01 33.63,12.12 35.23,7.01 36.91,24.1 35.59,19.53 39.95,10.08 37.82,12.32 32.03,4.09 23.32,6.32 11.4,10.39 25.02,12.93 25.02,14.05 16.87,6.55 13.44,10.39 33.83,22.07 62.92,5.33 62.92,3.56 52.6,17.05 60.44,25.57
  pour Top (isolate 0.254, rank 6, no thermals): 58.66,20.78 58.55,23.75 54.61,24.36 54.61,25.51 51.69,25.51 51.69,30.48 68.58,30.48 68.58,20.83
  pour Top (isolate 0.152, no thermals): 51.69,26.29 51.69,23.09 52.07,23.09 52.07,19.92 50.04,19.92 50.04,17.78 53.98,17.78 53.98,22.97 52.96,22.97 52.96,26.29
  pour Top (isolate 0.152, no thermals): 51.69,26.29 51.69,23.09 52.07,23.09 52.07,19.92 50.04,19.92 50.04,17.78 53.98,17.78 53.98,22.97 52.96,22.97 52.96,26.29
  pour Top (isolate 0.305, rank 6, no thermals): 6.91,30.48 68.58,30.48 68.58,0 6.91,0
  pour Bottom (isolate 0.305, rank 6, no thermals): 6.91,30.48 68.58,30.48 68.58,0 6.91,0
HOST  (via drill 0.3 pad 0.64)
  Top 0.203: v26.42,17.2 26.42,18.19 U1.40 28.81,20.59 R2.1
  Top 0.305: Q2.1 38.39,18.81 arc45 v38.35,18.8
  Bottom 0.203: 38.23,18.67 v38.35,18.8 36.75,17.2 v26.42,17.2
MCLR
  Top 0.203: U1.7 17.14,10.33 R8.1
N$1
  Top 0.406: R3.B 39.83,16.26 Q1.1
N$2
  Top 0.203: D3.A 33.25,16.12 R7.1
  Top 0.61: 33.17,15.99 R7.1
N$3
  Top 0.203: R9.1 63.12,27.94 63.37,28.19 63.37,28.93 63.09,29.21 D5.A
N$4
  Top 0.813: F1.2 44.32,12.32 | 44.32,12.32 43.18,12.32 41.74,13.76 Q1.3 | D1.A 44.31,12.31 44.32,12.32
N$5
  Top 0.203: C7.A 17.12,20.47 17.37,20.22 18.49,20.22 U1.56
N$6
  Top 0.279: U2.1 50.47,22.7 50.42,22.66 | 50.48,22.05 50.63,22.2 U2.2 | 50.6,21.7 50.41,21.51 | U2.3 50.6,21.7 | 50.6,21.7
  pour Top (isolate 0.152, rank 5, no thermals): 51.82,21.57 51.82,22.84 44.48,22.74 arc90 44.23,22.49 44.23,20.54 arc90 44.48,20.29 50.29,20.3 arc90 50.55,20.55 50.55,21.32 arc-90 50.8,21.57
N$7
  Top 0.203: C8.1 54.1,19.42 54.41,19.73 54.41,19.75 54.94,20.27 54.94,21.09 54.83,21.2 54.81,21.18 U2.9
N$8
  Top 0.813: R3.C 42.19,17.41 Q2.3
N$9
  Top 0.203: U1.19 26.2,8.27 26.64,7.82 | 26.64,7.82 26.17,7.35 C1.1 | 26.64,7.82 27.19,8.37 L1.1
N$12
  Top 0.203: Q3.1 D2.A 56.2,16.04 55.65,16.04 55.23,15.61 R4.1
P7
  Top 0.203: R1.1 R8.2 13.06,6.35 JP15.1
PIN1  (via drill 0.3 pad 0.64)
  Top 0.203: U1.31 28.83,14.12 27.81,14.12 v27.43,13.74
  Bottom 0.203: v27.43,13.74 27.84,14.15 27.84,15.04 27.43,15.44 25.7,15.44 25.2,15.95 25.2,17.48 35.29,27.57 54.24,27.57 JP20.1
PIN2  (via drill 0.3 pad 0.64)
  Top 0.203: U1.32 28.95,14.71 v26.82,14.71
  Bottom 0.203: v26.82,14.71 25.83,14.71 24.79,15.75 24.79,17.7 35.04,27.95 52.08,27.95 JP20.2
PIN3
  Top 0.203: JP20.3 48.26,26.67 40.89,26.67 40.13,25.91 37.62,25.91 34.78,23.06 29.87,23.06 29.47,22.66 29.16,22.35 U1.42
PIN4
  Top 0.203: JP20.4 46.1,27.05 40.66,27.05 39.93,26.31 37.39,26.31 34.54,23.47 29.57,23.47 29.17,23.07 29.17,23.06 28.84,22.73 U1.43
PIN5
  Top 0.203: JP20.5 43.94,27.43 40.44,27.43 39.73,26.72 37.12,26.72 34.27,23.88 29.27,23.88 28.51,23.11 U1.44
PIN6
  Top 0.203: JP20.6 41.78,27.81 40.21,27.81 39.52,27.13 36.88,27.13 34.04,24.28 28.97,24.28 28.57,23.88 28.25,23.56 U1.45
PIN7
  Top 0.203: JP20.7 38.96,27.53 36.68,27.53 33.83,24.69 28.67,24.69 U1.46
PIN8
  Top 0.203: 24.89,21.61 U1.47 28.37,25.09 33.63,25.09 36.47,27.94 36.83,27.94 JP20.8
PIN9
  Top 0.203: JP20.9 35.56,27.64 33.43,25.5 28.07,25.5 U1.48
PIN10
  Top 0.203: U1.49 21.08,22.57 21.08,24.95 21.63,25.5 21.64,25.5 22.25,26.11 25.3,26.11 26.11,26.92 30.73,26.92 JP20.10
PIN11
  Top 0.203: U1.50 20.7,22.25 20.7,25.17 22.05,26.52 25.09,26.52 25.91,27.33 28.6,27.33 JP20.11
PIN12
  Top 0.203: U1.51 20.32,21.92 20.32,25.38 21.87,26.92 24.89,26.92 25.7,27.74 26.47,27.74 JP20.12
PIN13
  Top 0.203: U1.52 19.94,21.6 19.94,25.58 21.69,27.33 23.52,27.33 JP20.13
PIN14
  Top 0.203: U1.53 19.56,21.27 19.56,25.91 JP20.14
PIN15
  Top 0.203: U1.54 19.18,20.95 19.18,28.07 19.58,28.47 JP20.15
PIN16
  Top 0.203: U1.55 18.8,20.62 18.8,28.19 JP20.16
PIN17
  Top 0.203: U1.58 17.48,19.81 16.36,19.81 16.2,19.96 15.54,20.62 15.24,20.93 JP20.17
PIN18
  Top 0.203: U1.59 17.18,19.41 16.2,19.41 14.83,20.77 14.83,27.08 JP20.18
PIN19
  Top 0.203: U1.60 16.88,19 16.01,19 14.43,20.58 14.43,26.18 13.28,27.33 12.04,27.33 JP20.19
PIN20
  Top 0.203: U1.61 16.58,18.59 15.77,18.59 14.02,20.34 14.02,25.92 13.02,26.92 9.91,26.92 JP9.11
PIN21
  Top 0.203: U1.62 16.28,18.19 15.57,18.19 13.61,20.14 13.61,25.7 12.8,26.52 7.77,26.52 JP9.10
PIN22
  Top 0.203: U1.63 15.98,17.78 15.3,17.78 13.21,19.87 13.21,25.4 12.5,26.11 9.6,26.11 JP9.9
PIN23
  Top 0.203: U1.64 15.68,17.37 15.06,17.37 12.8,19.63 12.8,25.09 12.19,25.7 9.96,25.7 9.14,24.89 9.14,23.11 JP9.8
PIN24
  Top 0.203: JP9.7 9.96,16.71 9.96,13.82 10.26,13.51 16.08,13.51 U1.1
PIN25
  Top 0.203: U1.2 16.36,13.08 9.68,13.08 9.35,13.41 9.35,14.78 JP9.6
PIN26
  Top 0.203: U1.3 16.66,12.68 8.91,12.68 JP9.5
PIN27
  Top 0.203: U1.4 16.96,12.27 8.46,12.27 JP9.4
PIN28
  Top 0.203: JP9.3 9.04,10.31 9.04,10.97 9.93,11.86 17.26,11.86 U1.5
PIN29
  Top 0.203: U1.6 17.56,11.46 10.13,11.46 9.45,10.77 9.45,8.18 JP9.2
PIN30  (via drill 0.3 pad 0.64)
  Top 0.203: U1.8 19.28,11.76 v19.28,12.68
  Bottom 0.203: JP9.1 11.94,8.13 16,8.13 19.28,11.4 v19.28,12.68
PIN31
  Top 0.203: U1.11 19.43,9.79 19.43,4.8 19,4.37 18.2,4.37 17.79,3.96 15.75,3.96 15.31,3.51 13.47,3.51 12.94,2.99 9.34,2.99 JP7.16
PIN32
  Top 0.203: U1.12 19.81,9.46 19.81,4.27 19.51,3.96 18.47,3.96 18.01,3.5 15.98,3.5 15.52,3.04 13.7,3.04 13.18,2.52 11.41,2.52 JP7.15
PIN33
  Top 0.203: U1.13 20.19,9.14 20.19,3.83 19.91,3.56 18.76,3.56 18.23,3.03 16.21,3.03 15.74,2.56 13.99,2.56 JP7.14
PIN34
  Top 0.203: U1.14 20.57,8.81 20.57,3.5 20.22,3.15 19.05,3.15 18.45,2.55 16.52,2.55 JP7.13
PIN35
  Top 0.203: U1.15 20.95,8.48 20.95,3.28 20.42,2.74 19.25,2.74 JP7.12
PIN36
  Top 0.203: U1.16 21.34,8.16 21.34,2.29 JP7.11
PIN37
  Top 0.203: U1.17 24.89,8.16 24.89,7.82 24.23,7.16 24.23,5.64 24.89,4.98 24.89,3.3 JP7.10
PIN38
  Top 0.203: U1.18 25.27,8.48 25.38,8.38 25.38,7.75 24.71,7.09 24.71,5.94 25.4,5.26 JP7.9
PIN39
  Top 0.203: U1.21 26.42,9.46 27.37,9.46 30.07,6.76 30.07,3.4 JP7.8
PIN40
  Top 0.203: U1.22 26.74,9.84 27.55,9.84 30.48,6.91 JP7.7
PIN41
  Top 0.203: U1.23 27.07,10.22 27.72,10.22 30.89,7.06 30.89,3.4 JP7.6
PIN42
  Top 0.203: U1.24 27.4,10.6 27.9,10.6 31.29,7.21 31.29,3.66 32.21,2.74 34.09,2.74 JP7.5
PIN43
  Top 0.203: U1.27 28.07,12.06 28.57,11.56 30.66,11.56 32.77,9.45 32.77,4.32 33.93,3.15 36.22,3.15 JP7.4
PIN44
  Top 0.203: U1.28 28.89,11.94 30.89,11.94 33.17,9.65 33.17,4.52 34.14,3.56 38.35,3.56 JP7.3
PIN45
  Top 0.203: U1.29 29.22,12.32 31.11,12.32 33.58,9.86 33.58,4.83 34.44,3.96 40.49,3.96 JP7.2
PIN46
  Top 0.203: U1.30 29.54,12.7 31.34,12.7 33.98,10.06 33.98,5.13 34.75,4.37 42.62,4.37 JP7.1
USBID  (via drill 0.3 pad 0.64)
  Top 0.203: 56.27,9.27 39.55,9.27 35.66,13.16 v35.66,16.08 | U1.33 | 30.07,16.89 U1.33 | v30.81,16.08 30.41,16.08 U1.33 | JP21.ID1 62.72,10.81 v62.36,11.18 60.45,9.27 57.15,9.27 56.27,9.27 | S1.P 56.27,9.27
  Bottom 0.203: v62.36,11.18 65.02,11.18 65.66,11.81 TP1.P$1 | v30.81,16.08 v35.66,16.08
VBUS  (via drill 0.3 pad 0.64)
  Top 0.203: U1.34 29.96,17.49 30.64,17.49 31.11,17.02 31.62,17.02 31.75,17.14 33.96,17.14 34.16,16.94 34.16,12.71 38.74,8.13 49.02,8.13 v49.4,7.75 49.28,7.87 | JP21.VBUS1 63.47,8.86
  Top 0.406: 63.47,8.86 62.87,8.26
  Top 0.61: 62.87,8.26 62.48,7.87 49.53,7.87 v49.4,7.75
  Top 0.813: F1.1 v48.64,12.32
  Bottom 0.61: v49.4,7.75 49.4,11.56 v48.64,12.32
VIN  (via drill 0.3 pad 0.64)
  Top 0.203: 55.5,21.32 55.63,21.44 55.72,21.35 C9.1 | 56.74,20.91 55.78,20.91 55.78,21.32 C9.1 | 57.15,18.54 57.66,18.54 | C9.1 55.75,21.26 | C9.1 55.4,21.71 U2.10 | D2.C 57.26,18.42 57.35,18.51
  Top 0.279: 54.46,23.82 54.08,24.2 53.88,24.2 53.72,24.03 U2.13 | U2.11 56.79,22.21 56.81,22.23 | U2.12 55.73,22.71 55.88,22.86
  Top 0.508: 57.66,18.54 57.71,18.49
  Top 1.016: v60.96,18.19 60.96,19.21 JP19.2
  Bottom 1.016: JP1.1 JP1.2 JP1.3 v60.96,18.19
  pour Top (isolate 0.152, rank 5, no thermals): 63.37,19.94 63.37,18.16 arc-90 63.12,17.91 56.77,17.91 arc-90 56.55,18.29 56.56,22.17 54.11,22.17 54.1,23.02 arc90 53.9,23.13 arc-90 53.68,23.2 53.68,24.11 arc-90 53.95,24.37 57.73,24.35 arc-90 58.15,24.09 58.2,20.45 arc90 58.52,20.19 63.12,20.19 arc-90

### Text on the board
Bottom: v22b
tPlace: +
bPlace: www.seeedstudio.com
Measures: Units are in inches
tDocu: Ytai Ben-tsvi | Revised by: | Aaron Weiss, Pete Lewis